# EAGLE design strip_charlie_12_trans (EAGLE 5.11)
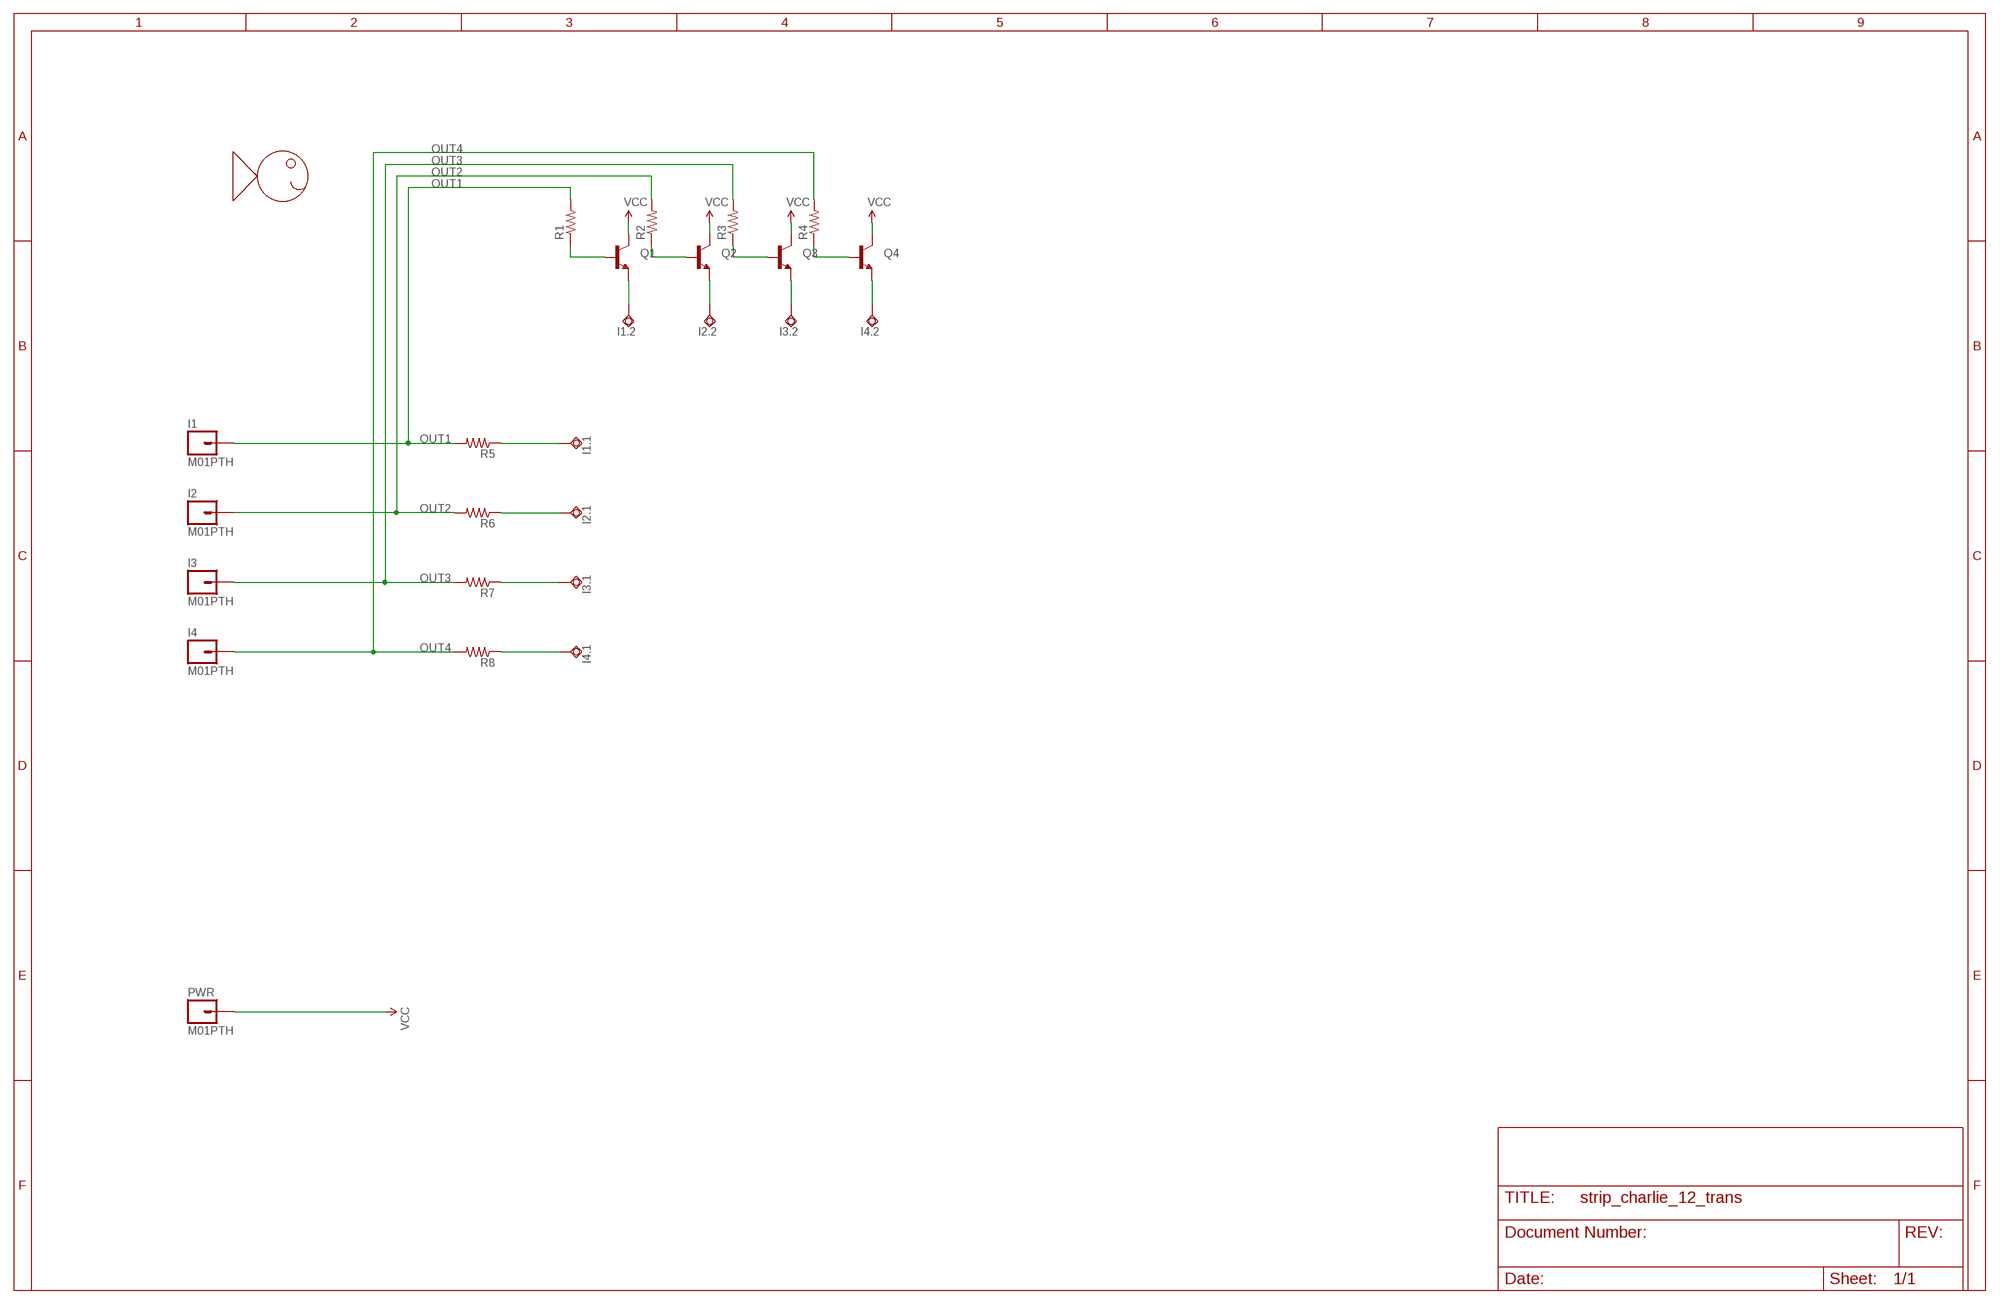
[diagram p0: schematic, sheet 1]

## Parts
I1  M01PTH  [1X01]
I1.1  TPSQTP15SQ  [TP15SQ]
I1.2  TPSQTP15SQ  [TP15SQ]
I2  M01PTH  [1X01]
I2.1  TPSQTP15SQ  [TP15SQ]
I2.2  TPSQTP15SQ  [TP15SQ]
I3  M01PTH  [1X01]
I3.1  TPSQTP15SQ  [TP15SQ]
I3.2  TPSQTP15SQ  [TP15SQ]
I4  M01PTH  [1X01]
I4.1  TPSQTP15SQ  [TP15SQ]
I4.2  TPSQTP15SQ  [TP15SQ]
PWR  M01PTH  [1X01]
Q1  TRANSISTOR_NPNSOT23-3  [SOT23-3]
Q2  TRANSISTOR_NPNSOT23-3  [SOT23-3]
Q3  TRANSISTOR_NPNSOT23-3  [SOT23-3]
Q4  TRANSISTOR_NPNSOT23-3  [SOT23-3]
R1  RESISTOR0207/2V  [0207/2V]
R2  RESISTOR0207/2V  [0207/2V]
R3  RESISTOR0207/2V  [0207/2V]
R4  RESISTOR0207/2V  [0207/2V]
R5  RESISTOR0207/2V  [0207/2V]
R6  RESISTOR0207/2V  [0207/2V]
R7  RESISTOR0207/2V  [0207/2V]
R8  RESISTOR0207/2V  [0207/2V]
U$1  FHI_LOGO  [FHI_LOGO]

## Nets
N$15: Q1.1(B) R1.1
N$16: Q2.1(B) R2.1
N$17: Q3.1(B) R3.1
N$18: Q4.1(B) R4.1
OUT1: I1.1 R1.2 R5.2
OUT1_1: I1.1.TP R5.1
OUT1_2: I1.2.TP Q1.2(E)
OUT2: I2.1 R2.2 R6.2
OUT2_1: I2.1.TP R6.1
OUT2_2: I2.2.TP Q2.2(E)
OUT3: I3.1 R3.2 R7.2
OUT3_1: I3.1.TP R7.1
OUT3_2: I3.2.TP Q3.2(E)
OUT4: I4.1 R4.2 R8.2
OUT4_1: I4.1.TP R8.1
OUT4_2: I4.2.TP Q4.2(E)
VCC: PWR.1 Q1.3(C) Q2.3(C) Q3.3(C) Q4.3(C)

## Library data of the parts
I1-I4 PWR = SparkFun:M01: Header 1 Standard 1-pin 0.1" header. Use with straight break away headers (SKU : PRT-00116), right angle break away headers (PRT-00553), swiss pins (PRT-00743), machine pins (PRT-00117), and female headers (PRT-00115).
I1.1 I1.2 I2.1 I2.2 I3.1 I3.2 I4.1 I4.2 = CyberRailGuru:TPSQ: Test pad
Q1-Q4 = SparkFun:TRANSISTOR_NPN: Transistor NPN BJT configuration in SOT23 package. MMBT2222 is the common NPN we use. Double check BCE configuration again layout.
R1-R8 = CyberRailGuru:RESISTOR: RESISTOR, American symbol
U$1 = CyberRailGuru:FHI_LOGO: Fishhead Industries Logo

## Board
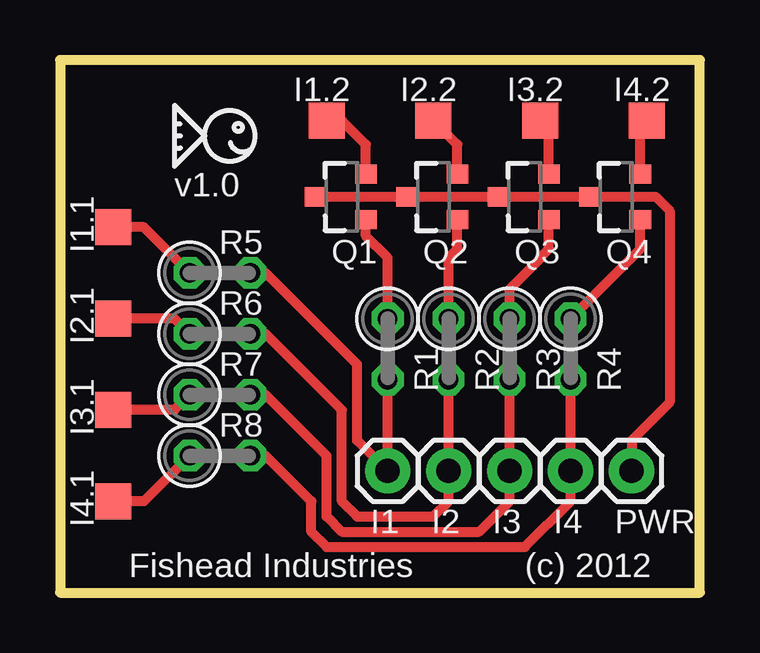
[diagram p1: board, top side]

Size 26.66 x 22.21 mm. Coordinates in mm from the lower left corner, seen from the top.
Outline: 0,0 26.66,0 26.66,22.21 0,22.21 0,0
Copper layers (1*16): Top 0.035mm / dielectric 1.5mm / Bottom 0.035mm
Design rules "Fusion_eagle_rule_v1.1": minimum track width 6mil, minimum drill 12mil, track to track 6mil, track to pad 6mil, pad to pad 6mil, via to via 6mil, smd to smd 0mil, copper to edge 10mil, drill to drill 10mil, minimum pad ring 10mil, minimum via ring 6mil, stop-mask expansion 2mil, vias tented up to drill 100mil, thermal gap 10mil

### Footprints (pad centres in the part's own frame; a part is rotated, then mirrored left to right if it is on the bottom)
1X01 = drill 1.016 pad 1.88 round: 1 0,0
TP15SQ = smd 1.5 x 1.5: TP 0,0
SOT23-3 = smd 0.8 x 0.9: 1 -0.95,-1; 2 0.95,-1; 3 0,1.1
0207/2V = drill 0.813 octagon: 1 -1.27,0; 2 1.27,0

### Placement (x,y rotation side)
I1  13.65,5.08 0 top
I1.1  2.22,15.24 0 top
I1.2  11.11,19.68 0 top
I2  16.19,5.08 0 top
I2.1  2.22,11.43 0 top
I2.2  15.56,19.68 0 top
I3  18.73,5.08 0 top
I3.1  2.22,7.62 0 top
I3.2  20,19.68 0 top
I4  21.27,5.08 0 top
I4.1  2.22,3.81 0 top
I4.2  24.45,19.68 0 top
PWR  23.81,5.08 0 top
Q1  11.75,16.51 90 top
Q2  15.56,16.51 90 top
Q3  19.37,16.51 90 top
Q4  23.18,16.51 90 top
R1  13.65,10.16 270 top
R2  16.19,10.16 270 top
R3  18.73,10.16 270 top
R4  21.27,10.16 270 top
R5  6.67,13.34 0 top
R6  6.67,10.79 0 top
R7  6.67,8.26 0 top
R8  6.67,5.71 0 top
U$1  6.03,19.05 0 top

### Tracks (layer width: path | path; a pad name or v marks a point on that pad's centre or on a via)
N$15
  Top 0.406: R1.1 13.65,13.97 12.75,14.88 Q1.1
N$16
  Top 0.406: Q2.1 16.56,14.34 16.19,13.97 R2.1
N$17
  Top 0.406: Q3.1 20.37,14.34 20,13.97 20,13.93 18.73,12.65 R3.1
N$18
  Top 0.406: Q4.1 24.18,14.34 R4.1
OUT1
  Top 0.406: R1.2 I1.1 12.38,6.35 12.38,9.53 8.57,13.34 R5.2
OUT1_1
  Top 0.406: R5.1 3.49,15.24 I1.1.TP
OUT1_2
  Top 0.406: Q1.2 12.75,18.68 11.75,19.68 I1.2.TP
OUT2
  Top 0.406: R2.2 I2.1 16.19,3.81 15.56,3.17 12.38,3.17 11.75,3.81 11.75,7.62 8.57,10.79 R6.2
OUT2_1
  Top 0.406: R6.1 4.76,11.43 I2.1.TP
OUT2_2
  Top 0.406: Q2.2 16.56,18.68 I2.2.TP
OUT3
  Top 0.406: R3.2 I3.1 18.73,3.81 17.46,2.54 11.75,2.54 11.11,3.17 11.11,5.71 8.57,8.26 R7.2
OUT3_1
  Top 0.406: R7.1 4.76,7.62 I3.1.TP
OUT3_2
  Top 0.406: Q3.2 20.37,19.32 I3.2.TP
OUT4
  Top 0.406: R4.2 I4.1 21.27,3.81 19.37,1.91 11.11,1.91 10.48,2.54 10.48,3.81 8.57,5.71 R8.2
OUT4_1
  Top 0.406: R8.1 3.49,3.81 I4.1.TP
OUT4_2
  Top 0.406: Q4.2 24.18,19.41 I4.2.TP
VCC
  Top 0.406: Q1.3 Q2.3 Q3.3 Q4.3 24.82,16.51 25.4,15.93 25.4,7.94 23.81,6.35 PWR.1

### Text on the board
tPlace: v1.0 | Fishead Industries | (c) 2012